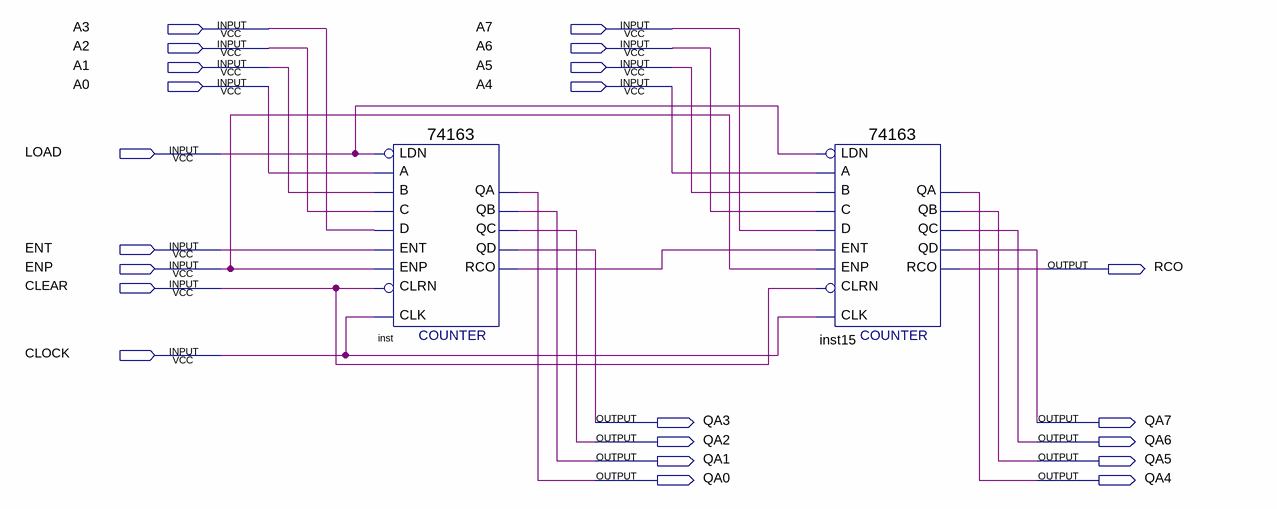
[diagram p0: schematic sheet]
// Quartus schematic Contador8Bits.bdf as structural Verilog: 2 symbols, 22 pins
module Contador8Bits (
  input  A3,
  input  A7,
  input  A2,
  input  A6,
  input  A1,
  input  A5,
  input  A0,
  input  A4,
  input  LOAD,
  input  ENT,
  input  ENP,
  input  CLEAR,
  input  CLOCK,
  output RCO,
  output QA3,
  output QA7,
  output QA2,
  output QA6,
  output QA1,
  output QA5,
  output QA0,
  output QA4
);

  wire inst_rco;

  \74163  inst (
    .C(A2), .B(A1), .A(A0), .ENT(ENT), .D(A3), .CLRN(CLEAR), .CLK(CLOCK), .ENP(ENP), .LDN(LOAD), .QA(QA0),
    .QB(QA1), .QC(QA2), .QD(QA3), .RCO(inst_rco));
  \74163  inst15 (
    .C(A6), .B(A5), .A(A4), .ENT(inst_rco), .D(A7), .CLRN(CLEAR), .CLK(CLOCK), .ENP(ENP), .LDN(LOAD),
    .QA(QA4), .QB(QA5), .QC(QA6), .QD(QA7), .RCO(RCO));
endmodule
